# Altium schematic sheet Serial IO Interface1.SchDoc: Cypress Molson - Serial I/O Interface (Primary)
size C; CompanyName: Linear Systems Ltd.; Organization: Linear Systems Ltd.; Address1: 1-1717 Dublin Ave.; Address2: Winnipeg, MB, Canada; Address3: R3H 0H2; DocumentNumber: LS7652; Revision: 1; SheetNumber: 10; SheetTotal: 12
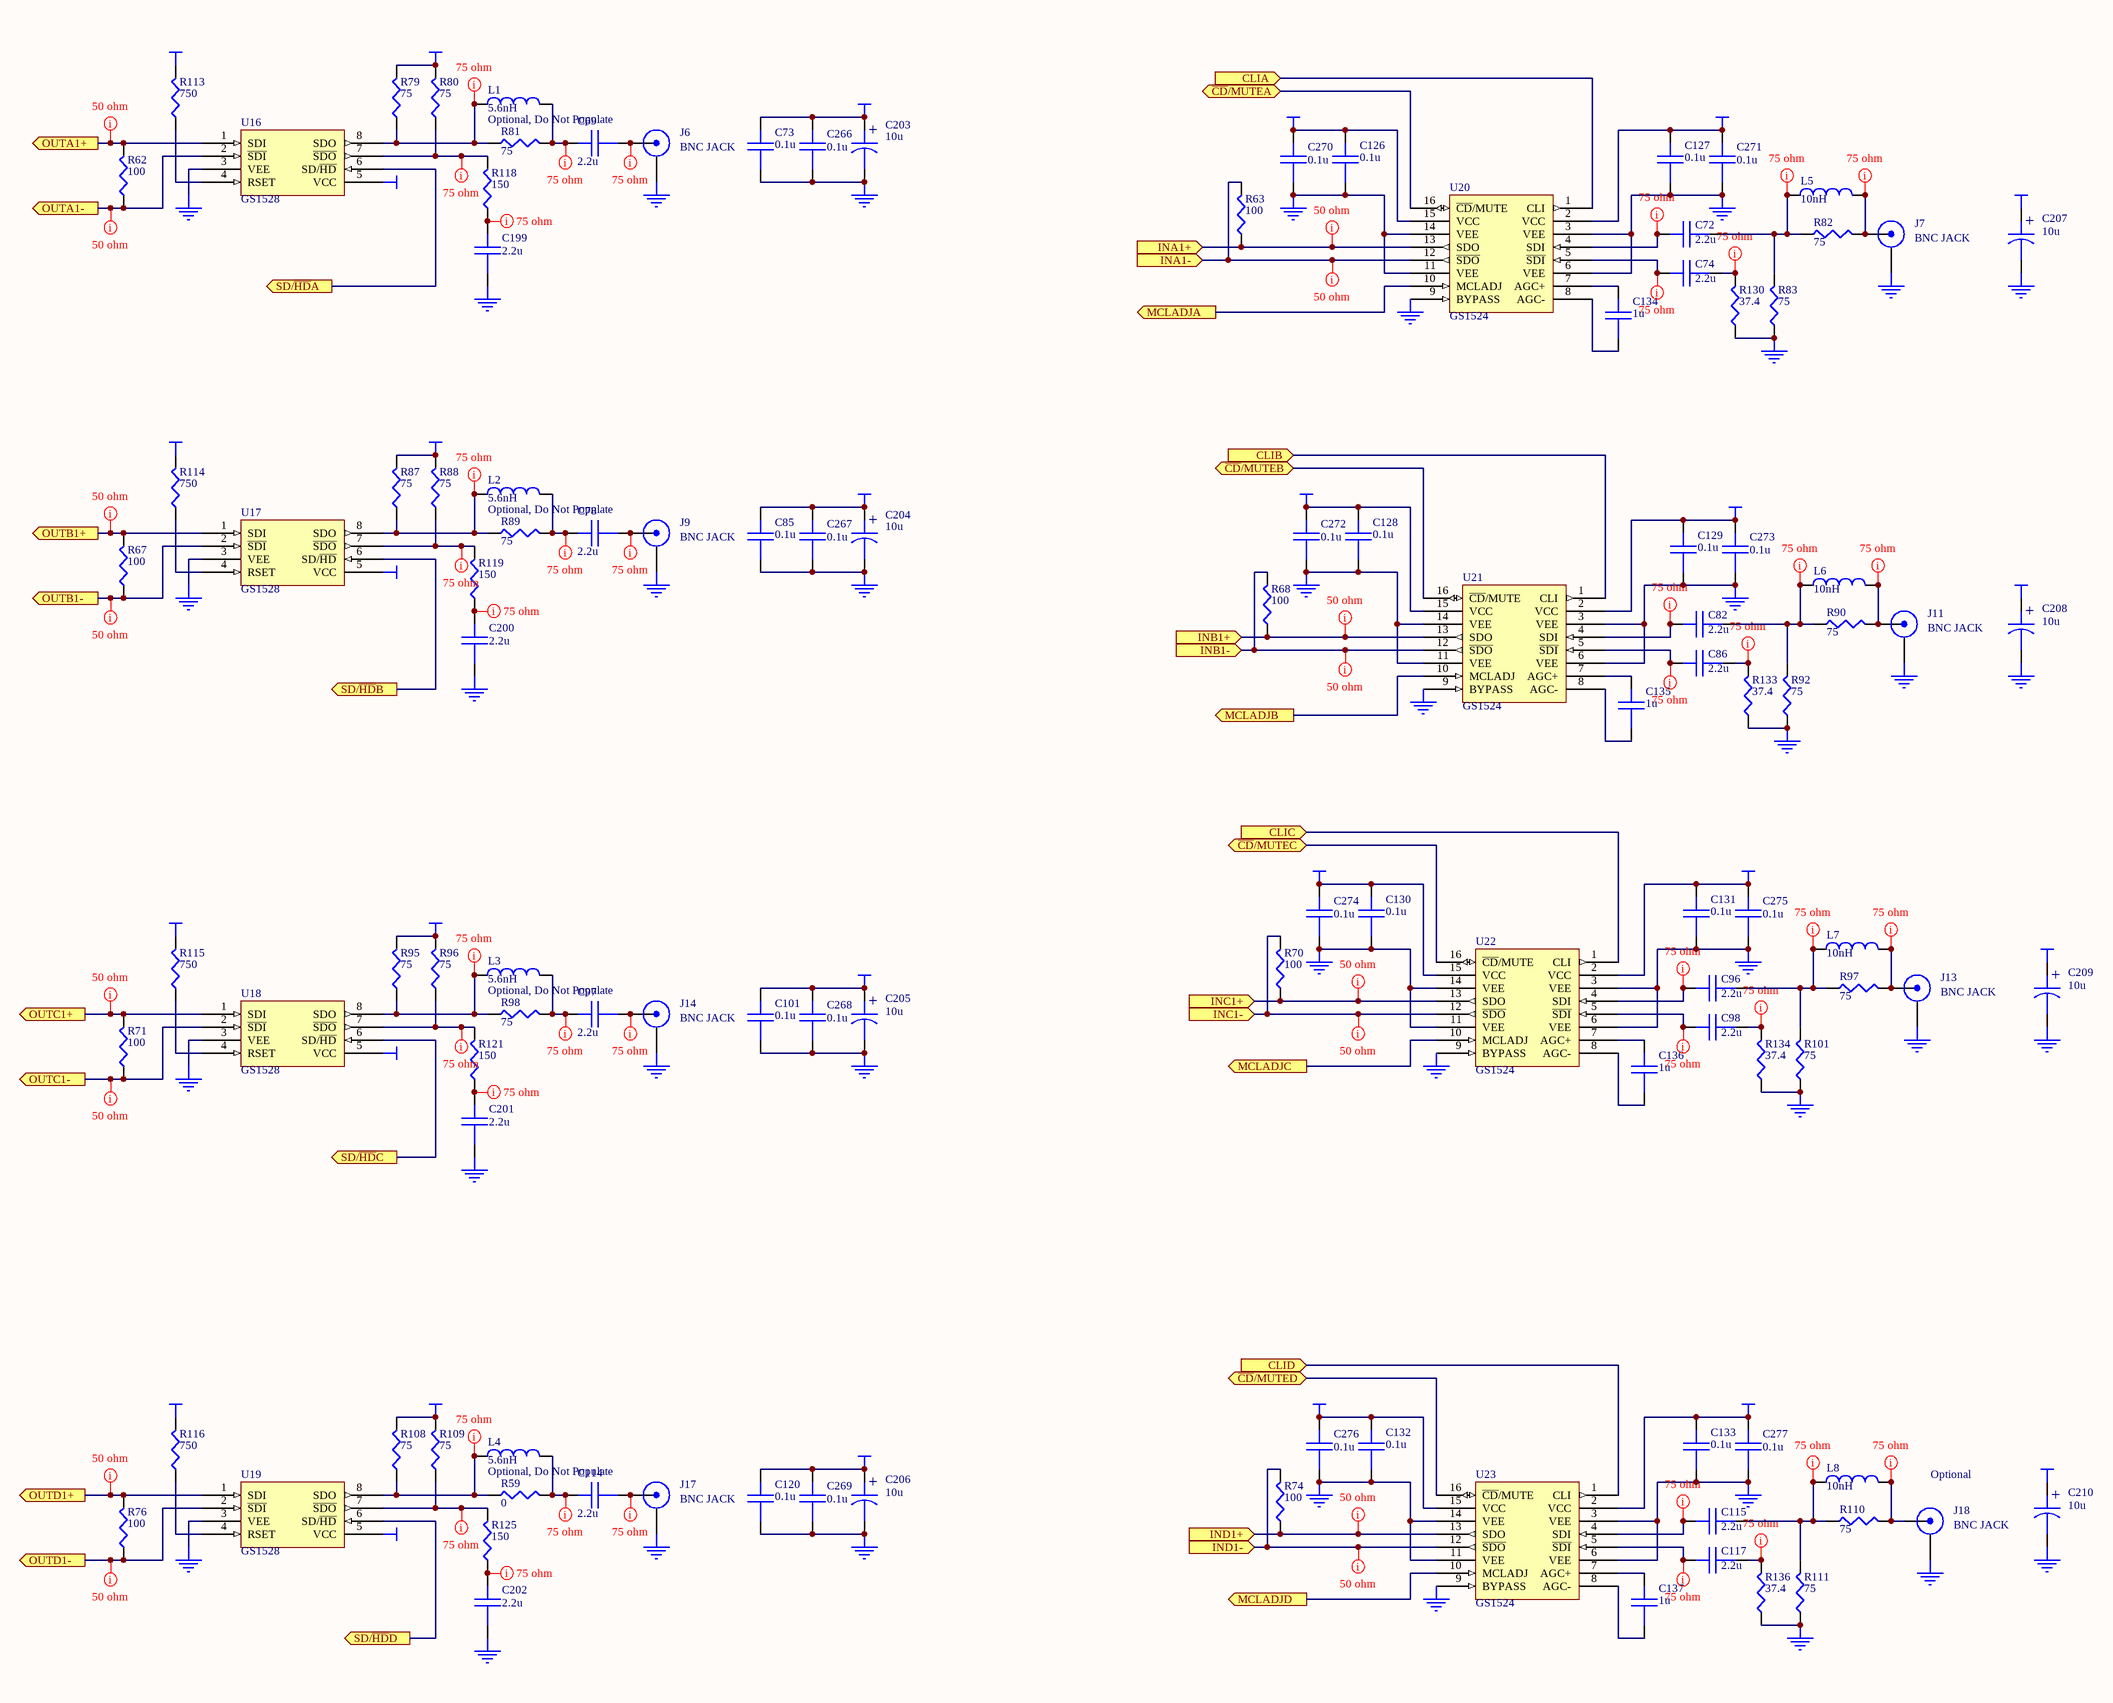
[diagram p0: Serial IO Interface1.SchDoc]

## Parts
C69  (no value)  [0603]
C72  (no value)  [0603]
C73  (no value)  [0603]
C74  (no value)  [0603]
C78  (no value)  [0603]
C82  (no value)  [0603]
C85  (no value)  [0603]
C86  (no value)  [0603]
C96  (no value)  [0603]
C97  (no value)  [0603]
C98  (no value)  [0603]
C101  (no value)  [0603]
C114  (no value)  [0603]
C115  (no value)  [0603]
C117  (no value)  [0603]
C120  (no value)  [0603]
C126  0.1u  [0603]
C127  0.1u  [0603]
C128  0.1u  [0603]
C129  0.1u  [0603]
C130  0.1u  [0603]
C131  0.1u  [0603]
C132  0.1u  [0603]
C133  0.1u  [0603]
C134  1u  [0603]
C135  1u  [0603]
C136  1u  [0603]
C137  1u  [0603]
C199  (no value)  [0603]
C200  (no value)  [0603]
C201  (no value)  [0603]
C202  (no value)  [0603]
C203  10u  [6032]
C204  10u  [6032]
C205  10u  [6032]
C206  10u  [6032]
C207  10u  [6032]
C208  10u  [6032]
C209  10u  [6032]
C210  10u  [6032]
C266  (no value)  [0603]
C267  (no value)  [0603]
C268  (no value)  [0603]
C269  (no value)  [0603]
C270  (no value)  [0603]
C271  (no value)  [0603]
C272  (no value)  [0603]
C273  (no value)  [0603]
C274  (no value)  [0603]
C275  (no value)  [0603]
C276  (no value)  [0603]
C277  (no value)  [0603]
J6  BNC JACK  [BNC-EDGE]
J7  BNC JACK  [BNC-EDGE]
J9  BNC JACK  [BNC-EDGE]
J11  BNC JACK  [BNC-EDGE]
J13  BNC JACK  [BNC-EDGE]
J14  BNC JACK  [BNC-EDGE]
J17  BNC JACK  [BNC-EDGE]
J18  BNC JACK  [BNC-EDGE]
L1  5.6nH  Note: Optional, Do Not Populate  [0805]
L2  5.6nH  Note: Optional, Do Not Populate  [0805]
L3  5.6nH  Note: Optional, Do Not Populate  [0805]
L4  5.6nH  Note: Optional, Do Not Populate  [0805]
L5  10nH  [0805]
L6  10nH  [0805]
L7  10nH  [0805]
L8  10nH  [0805]
R59  0  [0603]
R62  100  [0603]
R63  100  [0603]
R67  100  [0603]
R68  100  [0603]
R70  100  [0603]
R71  100  [0603]
R74  100  [0603]
R76  100  [0603]
R79  75  [0603]
R80  75  [0603]
R81  75  [0603]
R82  75  [0603]
R83  75  [0603]
R87  75  [0603]
R88  75  [0603]
R89  75  [0603]
R90  75  [0603]
R92  75  [0603]
R95  75  [0603]
R96  75  [0603]
R97  75  [0603]
R98  75  [0603]
R101  75  [0603]
R108  75  [0603]
R109  75  [0603]
R110  75  [0603]
R111  75  [0603]
R113  750  [0603]
R114  750  [0603]
R115  750  [0603]
R116  750  [0603]
R118  150  [0603]
R119  150  [0603]
R121  150  [0603]
R125  150  [0603]
R130  37.4  [0603]
R133  37.4  [0603]
R134  37.4  [0603]
R136  37.4  [0603]
U16  GS1528  [SO-8]
U17  GS1528  [SO-8]
U18  GS1528  [SO-8]
U19  GS1528  [SO-8]
U20  GS1524  [SO-16]
U21  GS1524  [SO-16]
U22  GS1524  [SO-16]
U23  GS1524  [SO-16]

## Ports
CLIA (in), CLIB (in), CLIC (in), CLID (in), INA1+ (in), INA1- (in), INB1+ (in), INB1- (in), INC1+ (in), INC1- (in), IND1+ (in), IND1- (in), MCLADJA (out), MCLADJB (out), MCLADJC (out), MCLADJD (out), OUTA1+ (out), OUTA1- (out), OUTB1+ (out), OUTB1- (out), OUTC1+ (out), OUTC1- (out), OUTD1+ (out), OUTD1- (out), SD/~{HD}A (out), SD/~{HD}B (out), SD/~{HD}C (out), SD/~{HD}D (out), ~{CD}/MUTEA (bidir), ~{CD}/MUTEB (bidir), ~{CD}/MUTEC (bidir), ~{CD}/MUTED (bidir)

## Nets
+3.3V: C73.1 C85.1 C101.1 C120.1 C126.1 C127.1 C128.1 C129.1 C130.1 C131.1 C132.1 C133.1 C203.1 C204.1 C205.1 C206.1 C207.1 C208.1 C209.1 C210.1 C266.1 C267.1 C268.1 C269.1 C270.1 C271.1 C272.1 C273.1 C274.1 C275.1 C276.1 C277.1 R79.2 R80.2 R87.2 R88.2 R95.2 R96.2 R108.2 R109.2 R113.2 R114.2 R115.2 R116.2 U16.5(VCC) U17.5(VCC) U18.5(VCC) U19.5(VCC) U20.2(VCC) U20.15(VCC) U21.2(VCC) U21.15(VCC) U22.2(VCC) U22.15(VCC) U23.2(VCC) U23.15(VCC)
GND: C73.2 C85.2 C101.2 C120.2 C126.2 C127.2 C128.2 C129.2 C130.2 C131.2 C132.2 C133.2 C199.2 C200.2 C201.2 C202.2 C203.2 C204.2 C205.2 C206.2 C207.2 C208.2 C209.2 C210.2 C266.2 C267.2 C268.2 C269.2 C270.2 C271.2 C272.2 C273.2 C274.2 C275.2 C276.2 C277.2 J6.2(GND) J7.2(GND) J9.2(GND) J11.2(GND) J13.2(GND) J14.2(GND) J17.2(GND) J18.2(GND) R83.1 R92.1 R101.1 R111.1 R130.1 R133.1 R134.1 R136.1 U16.3(VEE) U17.3(VEE) U18.3(VEE) U19.3(VEE) U20.3(VEE) U20.6(VEE) U20.9(BYPASS) U20.11(VEE) U20.14(VEE) U21.3(VEE) U21.6(VEE) U21.9(BYPASS) U21.11(VEE) U21.14(VEE) U22.3(VEE) U22.6(VEE) U22.9(BYPASS) U22.11(VEE) U22.14(VEE) U23.3(VEE) U23.6(VEE) U23.9(BYPASS) U23.11(VEE) U23.14(VEE)
~{CD}/MUTEA: U20.16(~{CD}/MUTE) ; port ~{CD}/MUTEA
~{CD}/MUTEB: U21.16(~{CD}/MUTE) ; port ~{CD}/MUTEB
~{CD}/MUTEC: U22.16(~{CD}/MUTE) ; port ~{CD}/MUTEC
~{CD}/MUTED: U23.16(~{CD}/MUTE) ; port ~{CD}/MUTED
CLIA: U20.1(CLI) ; port CLIA
CLIB: U21.1(CLI) ; port CLIB
CLIC: U22.1(CLI) ; port CLIC
CLID: U23.1(CLI) ; port CLID
INA1+: R63.1 U20.13(SDO) ; port INA1+
INA1-: R63.2 U20.12(~{SDO}) ; port INA1-
INB1+: R68.1 U21.13(SDO) ; port INB1+
INB1-: R68.2 U21.12(~{SDO}) ; port INB1-
INC1+: R70.1 U22.13(SDO) ; port INC1+
INC1-: R70.2 U22.12(~{SDO}) ; port INC1-
IND1+: R74.1 U23.13(SDO) ; port IND1+
IND1-: R74.2 U23.12(~{SDO}) ; port IND1-
MCLADJA: U20.10(MCLADJ) ; port MCLADJA
MCLADJB: U21.10(MCLADJ) ; port MCLADJB
MCLADJC: U22.10(MCLADJ) ; port MCLADJC
MCLADJD: U23.10(MCLADJ) ; port MCLADJD
OUTA1+: R62.2 U16.1(SDI) ; port OUTA1+
OUTA1-: R62.1 U16.2(~{SDI}) ; port OUTA1-
OUTB1+: R67.2 U17.1(SDI) ; port OUTB1+
OUTB1-: R67.1 U17.2(~{SDI}) ; port OUTB1-
OUTC1+: R71.2 U18.1(SDI) ; port OUTC1+
OUTC1-: R71.1 U18.2(~{SDI}) ; port OUTC1-
OUTD1+: R76.2 U19.1(SDI) ; port OUTD1+
OUTD1-: R76.1 U19.2(~{SDI}) ; port OUTD1-
SD/~{HD}A: U16.6(SD/~{HD}) ; port SD/~{HD}A
SD/~{HD}B: U17.6(SD/~{HD}) ; port SD/~{HD}B
SD/~{HD}C: U18.6(SD/~{HD}) ; port SD/~{HD}C
SD/~{HD}D: U19.6(SD/~{HD}) ; port SD/~{HD}D
NetC69_1: C69.1 L1.2 R81.2
NetC69_2: C69.2 J6.1(SIGNAL)
NetC72_1: C72.1 U20.4(SDI)
NetC72_2: C72.2 L5.1 R82.1 R83.2
NetC74_1: C74.1 U20.5(~{SDI})
NetC74_2: C74.2 R130.2
NetC78_1: C78.1 L2.2 R89.2
NetC78_2: C78.2 J9.1(SIGNAL)
NetC82_1: C82.1 U21.4(SDI)
NetC82_2: C82.2 L6.1 R90.1 R92.2
NetC86_1: C86.1 U21.5(~{SDI})
NetC86_2: C86.2 R133.2
NetC96_1: C96.1 U22.4(SDI)
NetC96_2: C96.2 L7.1 R97.1 R101.2
NetC97_1: C97.1 L3.2 R98.2
NetC97_2: C97.2 J14.1(SIGNAL)
NetC98_1: C98.1 U22.5(~{SDI})
NetC98_2: C98.2 R134.2
NetC114_1: C114.1 L4.2 R59.2
NetC114_2: C114.2 J17.1(SIGNAL)
NetC115_1: C115.1 U23.4(SDI)
NetC115_2: C115.2 L8.1 R110.1 R111.2
NetC117_1: C117.1 U23.5(~{SDI})
NetC117_2: C117.2 R136.2
NetC134_1: C134.1 U20.7(AGC+)
NetC134_2: C134.2 U20.8(AGC-)
NetC135_1: C135.1 U21.7(AGC+)
NetC135_2: C135.2 U21.8(AGC-)
NetC136_1: C136.1 U22.7(AGC+)
NetC136_2: C136.2 U22.8(AGC-)
NetC137_1: C137.1 U23.7(AGC+)
NetC137_2: C137.2 U23.8(AGC-)
NetC199_1: C199.1 R118.1
NetC200_1: C200.1 R119.1
NetC201_1: C201.1 R121.1
NetC202_1: C202.1 R125.1
NetJ7_1: J7.1(SIGNAL) L5.2 R82.2
NetJ11_1: J11.1(SIGNAL) L6.2 R90.2
NetJ13_1: J13.1(SIGNAL) L7.2 R97.2
NetJ18_1: J18.1(SIGNAL) L8.2 R110.2
NetL1_1: L1.1 R79.1 R81.1 U16.8(SDO)
NetL2_1: L2.1 R87.1 R89.1 U17.8(SDO)
NetL3_1: L3.1 R95.1 R98.1 U18.8(SDO)
NetL4_1: L4.1 R59.1 R108.1 U19.8(SDO)
NetR80_1: R80.1 R118.2 U16.7(~{SDO})
NetR88_1: R88.1 R119.2 U17.7(~{SDO})
NetR96_1: R96.1 R121.2 U18.7(~{SDO})
NetR109_1: R109.1 R125.2 U19.7(~{SDO})
NetR113_1: R113.1 U16.4(RSET)
NetR114_1: R114.1 U17.4(RSET)
NetR115_1: R115.1 U18.4(RSET)
NetR116_1: R116.1 U19.4(RSET)

## Layout directives
rule Width Constraint [Pref Width = 10mil    Min Width = 10mil    Max Width = 10mil]: INA1+, INA1-, INB1+, INB1-, INC1+, INC1-, IND1+, IND1-, NetC69_1, NetC69_2, NetC72_1, NetC72_2, NetC74_1, NetC74_2, NetC78_1, NetC78_2, NetC82_1, NetC82_2, NetC86_1, NetC86_2, NetC96_1, NetC96_2, NetC97_1, NetC97_2, NetC98_1, NetC98_2, NetC114_1, NetC114_2, NetC115_1, NetC115_2, NetC117_1, NetC117_2, NetC199_1, NetC200_1, NetC201_1, NetC202_1, NetJ7_1, NetJ11_1, NetJ13_1, NetJ18_1, NetL1_1, NetL2_1, NetL3_1, NetL4_1, NetR80_1, NetR88_1, NetR96_1, NetR109_1, OUTA1+, OUTA1-, OUTB1+, OUTB1-, OUTC1+, OUTC1-, OUTD1+, OUTD1-

## Notes on the sheet
- Optional
- Size
- Date:
- File:
- B
- Drawing Number
- Sheet
- Drawn By:
- G. Cosens
- Revision
- of
- (in symbol CAPACITOR POL) +

## Library data of the parts
C69 C72-C74 C78 C82 C85 C86 C96-C98 C101 C114 C115 C117 C120 C126-C137 C199-C202 C266-C277 = CAP: SMT CAP
C203-C210 = CAPACITOR POL: Text Field1: 20; Text Field2: 20
L1-L8 = Inductor: Manufacturer: Generic Components; Class I: Passive; VALUE: 5.6n; Published: 8-Jun-2000; Revision: July-2002: Re-released for DXP Platform.; Publisher: Altium Limited; Class II: Inductor
R59 R62 R63 R67 R68 R70 R71 R74 R76 R79-R83 R87-R90 R92 R95-R98 R101 R108-R111 R113-R116 R118 R119 R121 R125 R130 R133 R134 R136 = RES1
U16-U19 = GS1528: HD-LINX II Multi-Rate SDI Dual Slew-Rate Cable Driver
U20-U23 = GS1524: HD-LINX II Multi-Rate SDI Adaptive Cable Equalizer